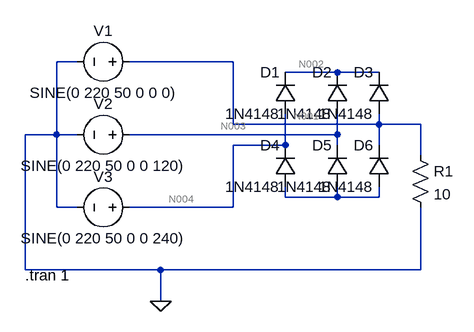
[diagram p0: schematic 3phase_full_wave_rectifier_diodes.asc]
3phase_full_wave_rectifier_diodes.asc, the LTspice schematic file:
Version 4
SHEET 1 880 680
WIRE -32 80 -64 80
WIRE 208 80 48 80
WIRE 368 96 288 96
WIRE 432 96 368 96
WIRE 208 176 208 80
WIRE 432 176 432 160
WIRE 432 176 208 176
WIRE 496 176 432 176
WIRE -64 192 -64 80
WIRE -64 192 -112 192
WIRE -32 192 -64 192
WIRE 368 192 368 160
WIRE 368 192 48 192
WIRE 288 208 288 160
WIRE 288 208 208 208
WIRE 368 208 368 192
WIRE 432 208 432 176
WIRE 496 224 496 176
WIRE 288 288 288 272
WIRE 368 288 368 272
WIRE 368 288 288 288
WIRE 432 288 432 272
WIRE 432 288 368 288
WIRE -64 304 -64 192
WIRE -32 304 -64 304
WIRE 208 304 208 208
WIRE 208 304 48 304
WIRE -112 400 -112 192
WIRE 96 400 -112 400
WIRE 496 400 496 304
WIRE 496 400 96 400
WIRE 96 448 96 400
FLAG 96 448 0
SYMBOL voltage 64 80 R90
WINDOW 0 -32 56 VBottom 2
WINDOW 3 32 56 VTop 2
WINDOW 123 0 0 Left 0
WINDOW 39 0 0 Left 0
SYMATTR InstName V1
SYMATTR Value SINE(0 220 50 0 0 0)
SYMBOL voltage 64 192 R90
WINDOW 0 -32 56 VBottom 2
WINDOW 3 32 56 VTop 2
WINDOW 123 0 0 Left 0
WINDOW 39 0 0 Left 0
SYMATTR InstName V2
SYMATTR Value SINE(0 220 50 0 0 120)
SYMBOL voltage 64 304 R90
WINDOW 0 -32 56 VBottom 2
WINDOW 3 32 56 VTop 2
WINDOW 123 0 0 Left 0
WINDOW 39 0 0 Left 0
SYMATTR InstName V3
SYMATTR Value SINE(0 220 50 0 0 240)
SYMBOL diode 304 160 R180
WINDOW 0 24 64 Left 2
WINDOW 3 24 0 Left 2
SYMATTR InstName D1
SYMATTR Value 1N4148
SYMBOL res 480 208 R0
SYMATTR InstName R1
SYMATTR Value 10
SYMBOL diode 384 160 R180
WINDOW 0 24 64 Left 2
WINDOW 3 24 0 Left 2
SYMATTR InstName D2
SYMATTR Value 1N4148
SYMBOL diode 448 160 R180
WINDOW 0 24 64 Left 2
WINDOW 3 24 0 Left 2
SYMATTR InstName D3
SYMATTR Value 1N4148
SYMBOL diode 304 272 R180
WINDOW 0 24 64 Left 2
WINDOW 3 24 0 Left 2
SYMATTR InstName D4
SYMATTR Value 1N4148
SYMBOL diode 384 272 R180
WINDOW 0 24 64 Left 2
WINDOW 3 24 0 Left 2
SYMATTR InstName D5
SYMATTR Value 1N4148
SYMBOL diode 448 272 R180
WINDOW 0 24 64 Left 2
WINDOW 3 24 0 Left 2
SYMATTR InstName D6
SYMATTR Value 1N4148
TEXT -112 408 Left 2 !.tran 1

The netlist it stands for:
* 3phase_full_wave_rectifier_diodes.asc
V1 N001 0 SINE(0 220 50 0 0 0)
V2 N003 0 SINE(0 220 50 0 0 120)
V3 N004 0 SINE(0 220 50 0 0 240)
D1 N004 N002 1N4148
R1 N001 0 10
D2 N003 N002 1N4148
D3 N001 N002 1N4148
D4 N005 N004 1N4148
D5 N005 N003 1N4148
D6 N005 N001 1N4148
.model D D
.lib standard.dio
.tran 1
.backanno
.end

* Results of the author's LTspice run, read from the files saved beside the schematic
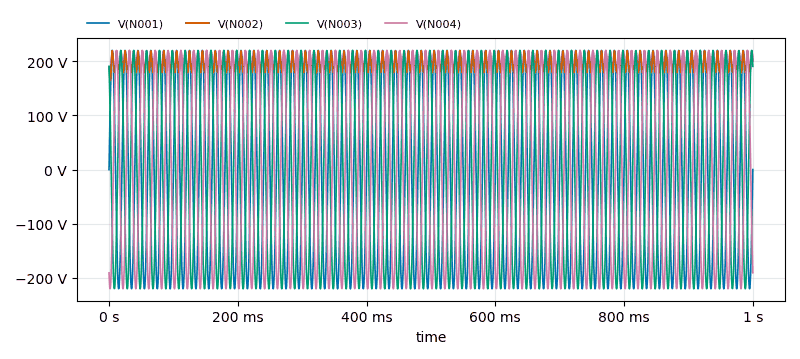
[diagram p1: Transient Analysis of 3phase_full_wave_rectifier_diodes.asc, plotted from the saved traces]
* Transient Analysis, 1 run:
*   V(N001): min -220 V, max 220 V, average 597.7 µV, rms 155.6 V, last 0 V
*   V(N002): min 164.2 V, max 219.7 V, average 197.9 V, rms 198.4 V, last 200.1 V
*   V(N003): min -220 V, max 220 V, average -962.5 µV, rms 155.6 V, last 190.5 V
*   V(N004): min -220 V, max 220 V, average 365 µV, rms 155.5 V, last -190.5 V